# EAGLE design MD_plate (EAGLE 7.2.0)
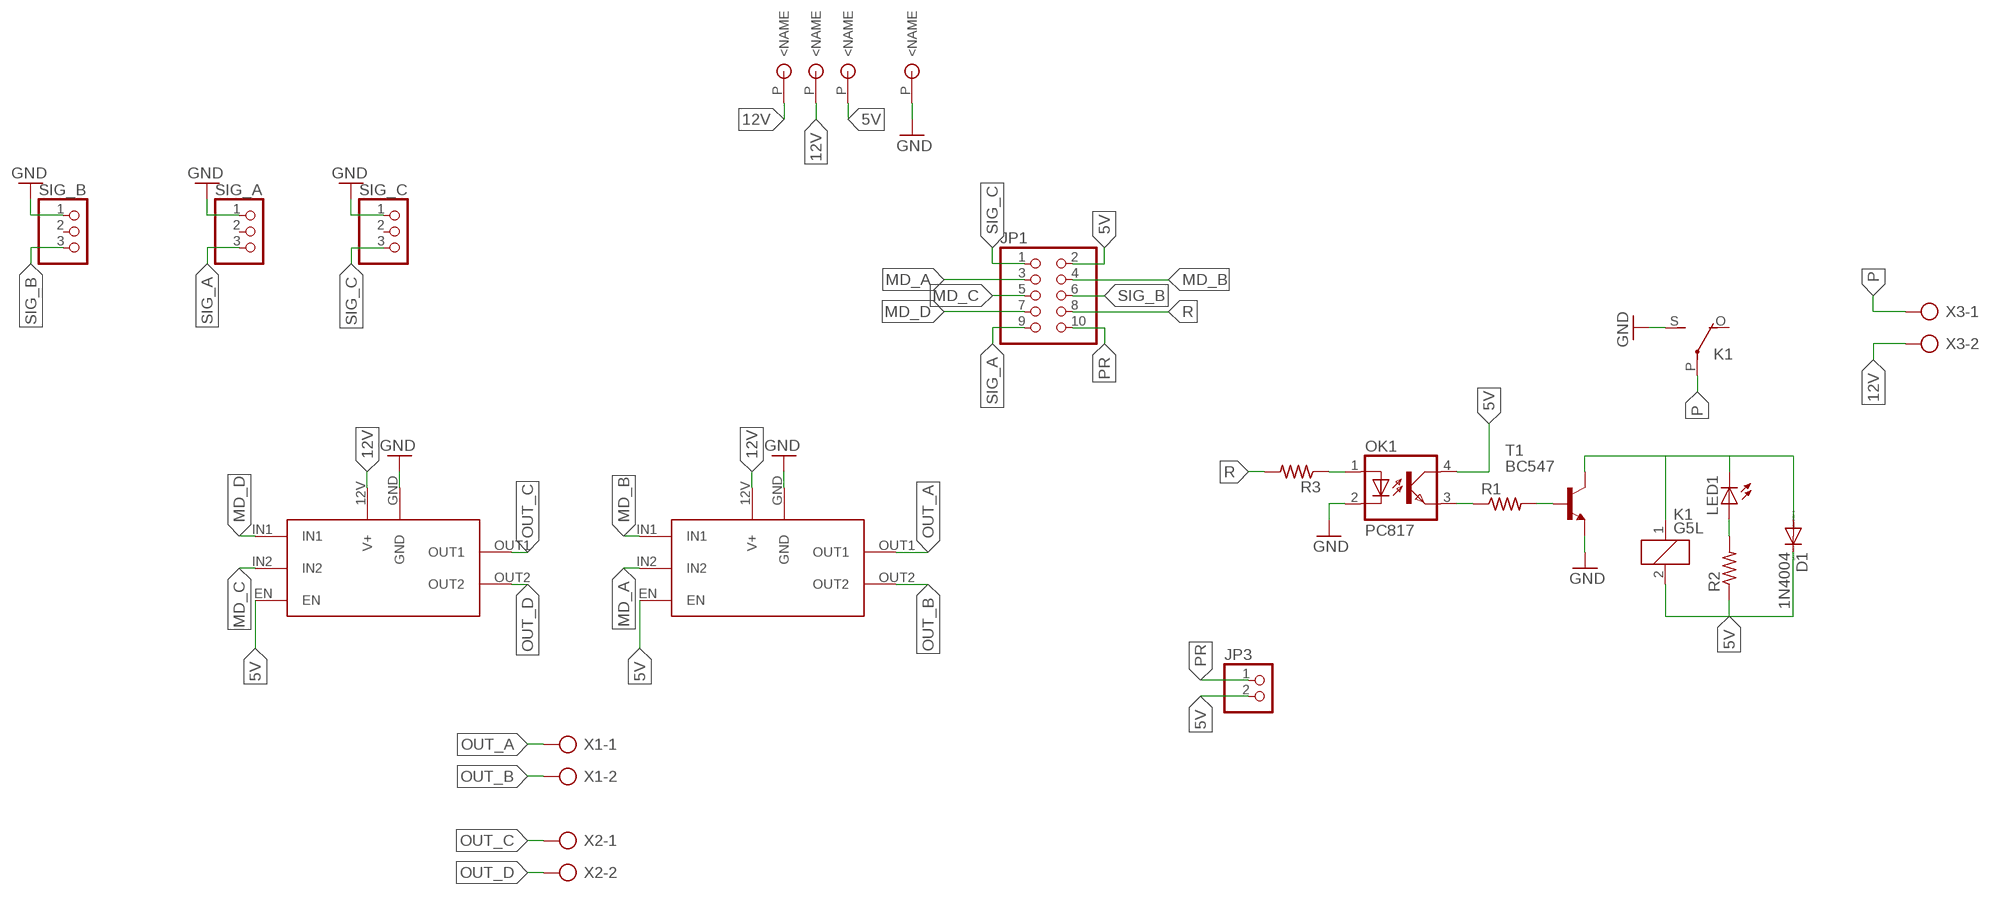
[diagram p0: schematic, sheet 1]

## Parts
6  CU-SPACER  [CU-SPACER]
12_A  CU-SPACER  [CU-SPACER]
12_B  CU-SPACER  [CU-SPACER]
D1  1N4004  [DO41-10]
JP1  PINHD-2X5  [2X05]
JP3  PINHD-1X2  [1X02]
K1  G5L  [G5LE]
LED1  LED3MM  [LED3MM]
OK1  PC817  [DIL04]
R1  R-US_0204/7  [0204/7]
R2  R-US_0204/7  [0204/7]
R3  R-US_0204/7  [0204/7]
SIG_A  PINHD-1X3/90  [1X03/90]
SIG_B  PINHD-1X3/90  [1X03/90]
SIG_C  PINHD-1X3/90  [1X03/90]
T1  BC547  [TO92]
U$1  L6203-MODULE  [L6203-MODULE]
U$2  L6203-MODULE  [L6203-MODULE]
U$6  CU-SPACER  [CU-SPACER]
X1  AK500/2  [AK500/2]
X2  AK500/2  [AK500/2]
X3  AK500/2  [AK500/2]

## Nets
5V: 6.P(<NAME) D1.C JP1.2 JP3.2 K1.2 OK1.4(COL) R2.1 U$1.EN U$2.EN
12V: 12_A.P(<NAME) 12_B.P(<NAME) U$1.12V(V+) U$2.12V(V+) X3.2
GND: K1.S(2:S) OK1.2(C) SIG_A.1 SIG_B.1 SIG_C.1 T1.1(E) U$1.GND U$2.GND U$6.P(<NAME)
MD_A: JP1.3 U$2.IN2
MD_B: JP1.4 U$2.IN1
MD_C: JP1.5 U$1.IN2
MD_D: JP1.7 U$1.IN1
N$2: OK1.3(EMIT) R1.1
N$3: R1.2 T1.2(B)
N$4: LED1.A R2.2
N$5: OK1.1(A) R3.1
N$6: D1.A K1.1 LED1.K(C) T1.3(C)
OUT_A: U$2.OUT1 X1.1
OUT_B: U$2.OUT2 X1.2
OUT_C: U$1.OUT1 X2.1
OUT_D: U$1.OUT2 X2.2
P: K1.P(2:P) X3.1
PR: JP1.10 JP3.1
R: JP1.8 R3.2
SIG_A: JP1.9 SIG_A.3
SIG_B: JP1.6 SIG_B.3
SIG_C: JP1.1 SIG_C.3
Unconnected: K1.O(2:O) SIG_A.2 SIG_B.2 SIG_C.2

## Library data of the parts
6 12_A 12_B U$6 = Aquaphoton:CU-SPACER
D1 = diode:1N4004: DIODE general purpose rectifier, 1 A
JP1 = pinhead:PINHD-2X5: PIN HEADER
JP3 = pinhead:PINHD-1X2: PIN HEADER
K1 = relay:G5L: RELAY 1 x switch, 10 A/120 V AC, 8 A/30 V ADC, Omron; OC_FARNELL: unknown; OC_NEWARK: unknown
LED1 = led:LED: LED OSRAM: - CHIPLED LG R971, LG N971, LY N971, LG Q971, LY Q971, LO R971, LY R971 LH N974, LH R974 LS Q976, LO Q976, LY Q976 LO Q996 - Hyper CHIPLED LW Q18S LB Q993, LB Q99A, LB R99A - SideLED LS A670, LO A670, LY A670, LG A670, LP A670 LB A673, LV A673, LT A673, LW A673 LH A674 LY A675 LS A676, LA A676, LO A676, LY A676, LW A676 LS A679, LY A679, LG A679 - Hyper Micro SIDELED® LS Y876, LA Y876, LO Y876, LY Y876 LT Y87S - SmartLED LW L88C, LW L88S LB L89C, LB L89S, LG L890 LS L89K, LO L89K, LY L89K LS L896, LA L896, LO L896, LY L896 - TOPLED LS T670, LO T670, LY T670, LG T670, LP T670 LSG T670, LSP T670, LSY T670, LOP T670, LYG T670 LG T671, LOG T671, LSG T671 LB T673, LV T673, LT T673, LW T673 LH T674 LS T676, LA T676, LO T676, LY T676, LB T676, LH T676, LSB T676, LW T676 LB T67C, LV T67C, LT T67C, LS T67K, LO T67K, LY T67K, LW E67C LS E67B, LA E67B, LO E67B, LY E67B, LB E67C, LV E67C, LT E67C LW T67C LS T679, LY T679, LG T679 LS T770, LO T770, LY T770, LG T770, LP T770 LB T773, LV T773, LT T773, LW T773 LH T774 LS E675, LA E675, LY E675, LS T675 LS T776, LA T776, LO T776, LY T776, LB T776 LHGB T686 LT T68C, LB T68C - Hyper Mini TOPLED® LB M676 - Mini TOPLED Santana® LG M470 LS M47K, LO M47K, LY M47K Source: http://www.osram.convergy.de LUXEON: - LUMILED® LXK2-PW12-R00, LXK2-PW12-S00, LXK2-PW14-U00, LXK2-PW14-V00 LXK2-PM12-R00, LXK2-PM12-S00, LXK2-PM14-U00 LXK2-PE12-Q00, LXK2-PE12-R00, LXK2-PE12-S00, LXK2-PE14-T00, LXK2-PE14-U00 LXK2-PB12-K00, LXK2-PB12-L00, LXK2-PB12-M00, LXK2-PB14-N00, LXK2-PB14-P00, LXK2-PB14-Q00 LXK2-PR12-L00, LXK2-PR12-M00, LXK2-PR14-Q00, LXK2-PR14-R00 LXK2-PD12-Q00, LXK2-PD12-R00, LXK2-PD12-S00 LXK2-PH12-R00, LXK2-PH12-S00 LXK2-PL12-P00, LXK2-PL12-Q00, LXK2-PL12-R00 Source: www.luxeon.com KINGBRIGHT: KA-3528ASYC Source: www.kingbright.com
OK1 = optocoupler:PC817: SHARP OPTO COUPLER; MPN: PC817X4J000F; OC_FARNELL: 9707727; OC_NEWARK: 97K7059
R1-R3 = rcl:R-US_: RESISTOR, American symbol
SIG_A SIG_B SIG_C = pinhead:PINHD-1X3: PIN HEADER
T1 = transistor:BC547: NPN TRANSISTOR
U$1 U$2 = Aquaphoton:L6203-MODULE
X1-X3 = con-ptr500:AK500/2: CONNECTOR; OC_FARNELL: unknown; OC_NEWARK: unknown

## Board
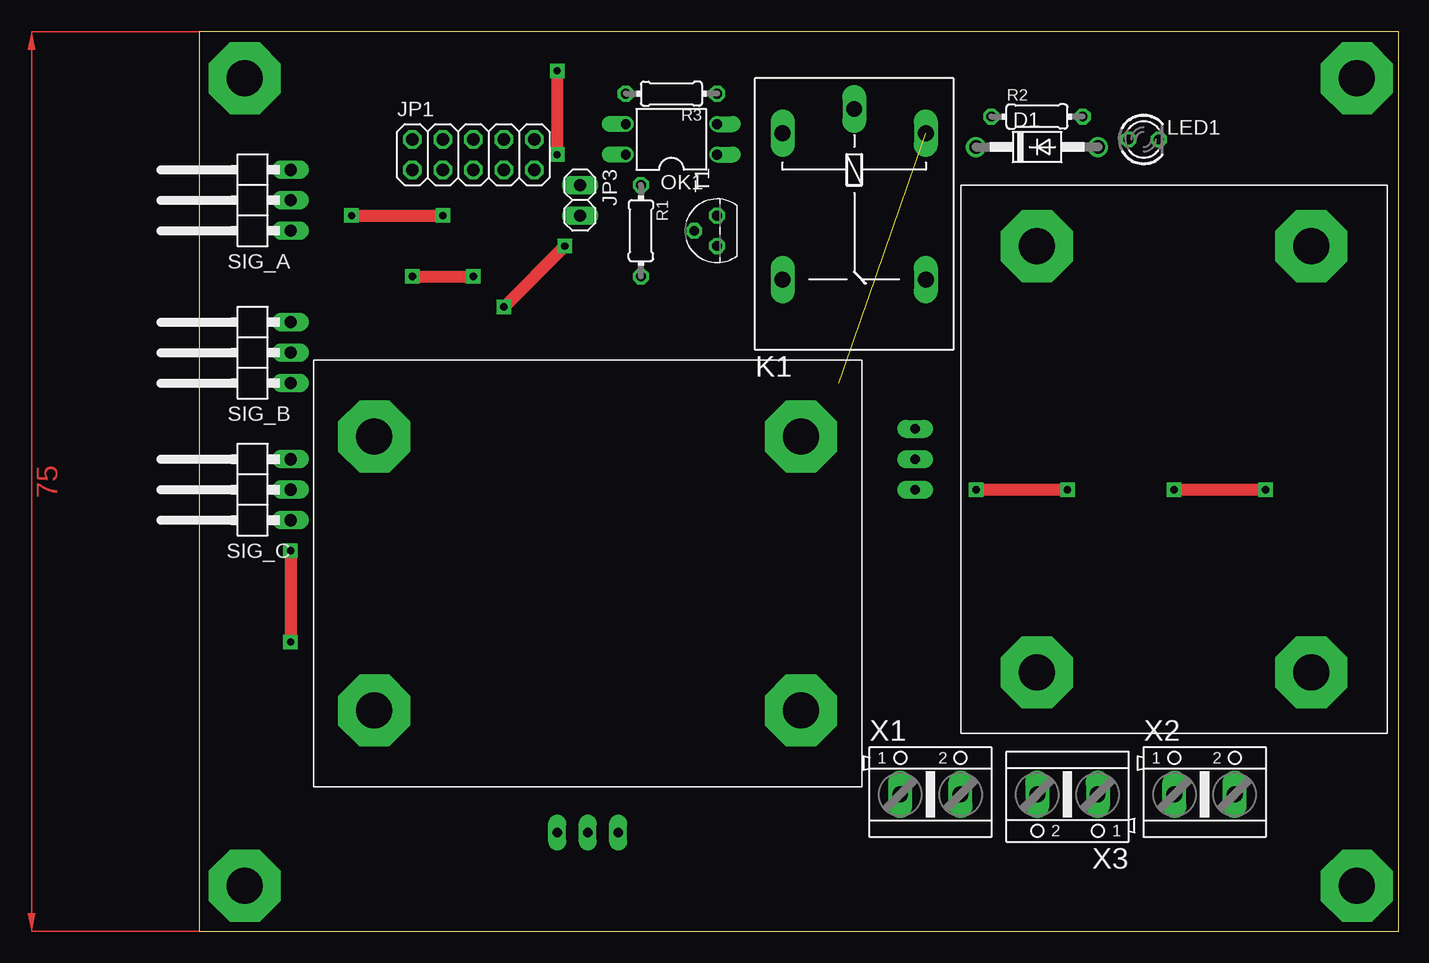
[diagram p1: board, top side]
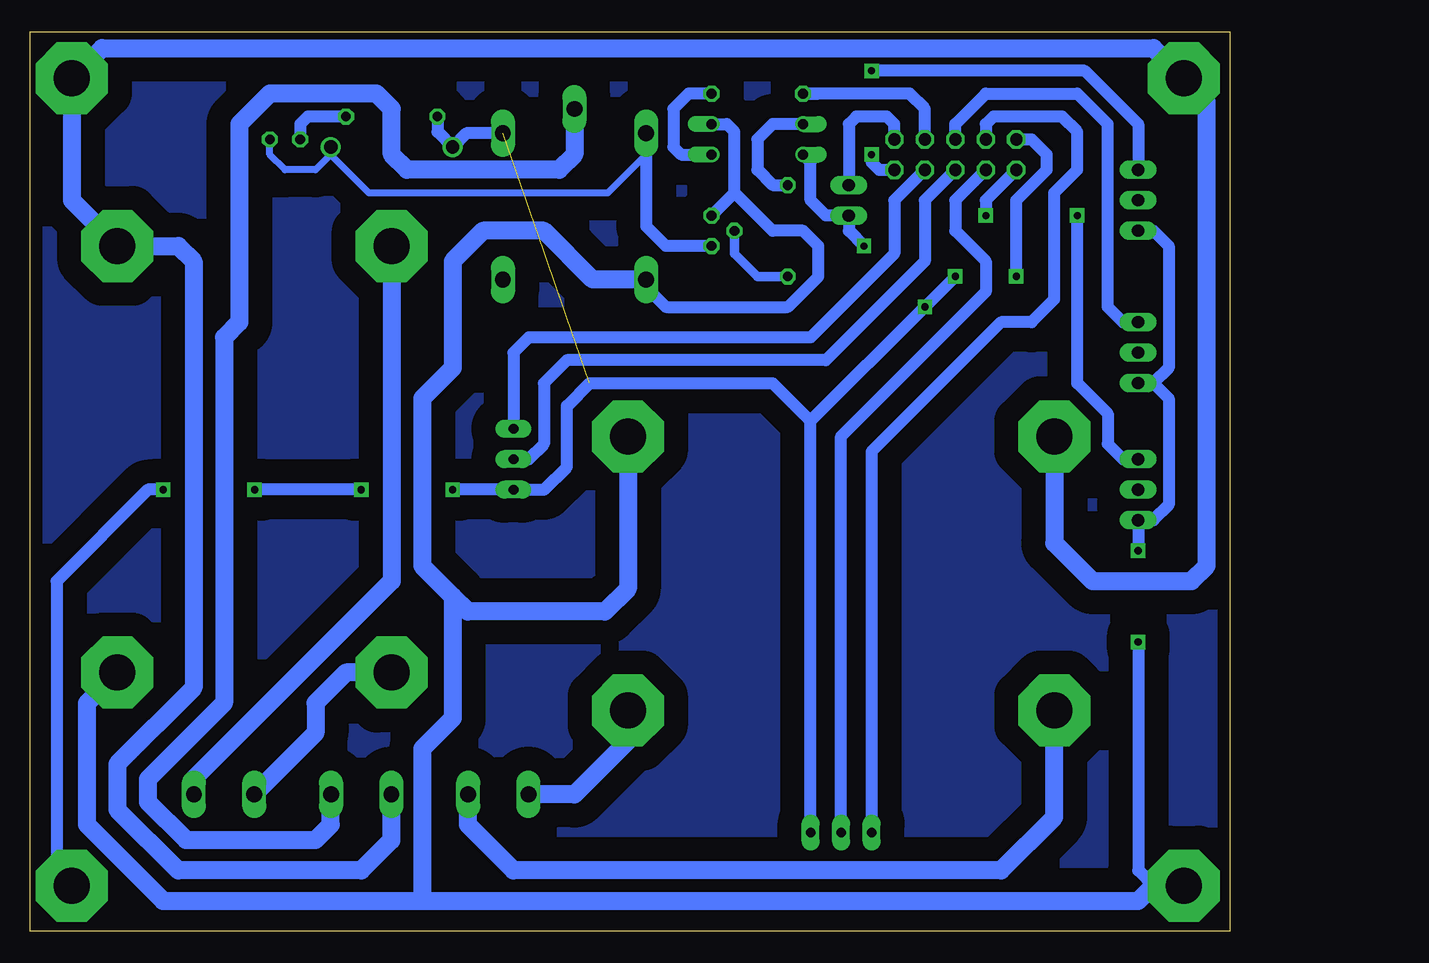
[diagram p2: board, bottom side, seen from below]

Size 100 x 75 mm. Coordinates in mm from the lower left corner, seen from the top.
Outline: 0,0 100,0 100,75 0,75 0,0
Copper layers (1*16): Top 0.035mm / dielectric 1.5mm / Bottom 0.035mm
Design rules "default *": minimum track width 10mil, minimum drill 24mil, track to track 2mm, track to pad 2mm, pad to pad 8mil, via to via 8mil, smd to smd 8mil, copper to edge 40mil, drill to drill 8mil, minimum pad ring 10mil, minimum via ring 8mil, stop-mask expansion 4mil, vias tented up to drill 0mil, thermal gap 10mil

### Footprints (pad centres in the part's own frame; a part is rotated, then mirrored left to right if it is on the bottom)
CU-SPACER = drill 3 pad 6 octagon: P 0,0
DO41-10 = drill 1.118: A 5.08,0; C -5.08,0
2X05 = drill 1.016 octagon: 1 -5.08,-1.27; 2 -5.08,1.27; 3 -2.54,-1.27; 4 -2.54,1.27; 5 0,-1.27; 6 0,1.27; 7 2.54,-1.27; 8 2.54,1.27; 9 5.08,-1.27; 10 5.08,1.27
1X02 = drill 1.016 long: 1 -1.27,0; 2 1.27,0
G5LE = drill 1.321 long: 1 -7.493,-5.969; 2 -7.493,5.969; O 4.699,5.969; P -9.525,0; S 4.699,-5.969
LED3MM = drill 0.813 octagon: A -1.27,0; K 1.27,0
DIL04 = drill 0.813 offset: 1 -1.27,-3.81; 2 1.27,-3.81; 3 1.27,3.81; 4 -1.27,3.81
0204/7 = drill 0.813 octagon: 1 -3.81,0; 2 3.81,0
1X03/90 = drill 1.016 long: 1 -2.54,-3.81; 2 0,-3.81; 3 2.54,-3.81
TO92 = drill 0.813 octagon: 1 1.27,0; 2 0,1.905; 3 -1.27,0
L6203-MODULE = drill 3 pad 6 octagon: 12V 5.08,29.21; GND 40.64,29.21; OUT1 40.64,6.35; OUT2 5.08,6.35 | drill 0.8 pad 1.5 long: EN 25.4,-3.81; IN1 20.32,-3.81; IN2 22.86,-3.81
AK500/2 = drill 1.321 long: 1 -2.515,0; 2 2.515,0

### Placement (x,y rotation side)
6  96.52,3.81 0 top
12_A  3.81,71.12 0 top
12_B  96.52,71.12 0 top
D1  69.85,65.41 0 top
JP1  22.86,64.77 0 top
JP3  31.75,60.96 270 top
K1  54.61,59.05 270 top
LED1  78.74,66.04 0 top
OK1  39.37,66.04 90 top
R1  36.83,58.42 270 top
R2  69.85,67.94 0 top
R3  39.37,69.85 180 top
SIG_A  3.81,60.96 90 top
SIG_B  3.81,48.26 90 top
SIG_C  3.81,36.83 90 top
T1  43.18,58.42 90 top
U$1  63.5,62.23 270 top
U$2  9.53,12.06 0 top
U$6  3.81,3.81 0 top
X1  60.96,11.43 0 top
X2  83.82,11.43 0 top
X3  72.39,11.43 180 top

### Tracks (layer width: path | path; a pad name or v marks a point on that pad's centre or on a via)
5V  (via drill 0.6 pad 1.2)  (1 unrouted)
  Top 1: v64.77,36.83 v72.39,36.83 | v17.78,54.61 v22.86,54.61 | v30.48,57.15 v25.4,52.07 | v81.28,36.83 v88.9,36.83
  Bottom 1: U$2.EN 34.92,42.55 | 34.92,42.55 38.1,45.72 53.34,45.72 55.24,43.81 55.24,38.73 57.15,36.83 U$1.EN v64.77,36.83 | 6.P 97.79,5.08 97.79,29.21 90.17,36.83 v88.9,36.83 | v22.86,54.61 v25.4,52.07 34.92,42.55 | v72.39,36.83 v81.28,36.83 | JP1.2 16.51,66.04 15.24,64.77 15.24,63.5 17.78,60.96 v17.78,54.61 | OK1.4 34.92,64.14 34.92,60.96 33.66,59.69 JP3.2 31.75,58.42 v30.48,57.15 | K1.2 63.63,66.55 D1.C 66.04,66.67 R2.1
12V
  Bottom 1.5: U$2.12V 14.61,32.38 11.43,29.21 3.17,29.21 1.91,30.48 1.91,69.22 12_A.P 6.35,73.66 93.98,73.66 12_B.P 96.52,60.96 U$1.12V 87.63,57.15 86.36,55.88 86.36,20.32 92.71,13.97 92.71,10.16 87.63,5.08 72.39,5.08 69.88,7.59 X3.2
GND  (via drill 0.6 pad 1.2)
  Top 1: v7.62,31.75 v7.62,24.13
  Bottom 1: OK1.2 41.91,67.31 41.27,66.67 41.27,61.59 | SIG_A.1 6.35,58.42 5.08,57.15 5.08,46.99 6.35,45.72 | SIG_B.1 6.35,45.72 | 6.35,45.72 5.08,44.45 5.08,35.56 6.35,34.29 SIG_C.1 v7.62,31.75 | T1.1 41.27,61.59 | K1.S 48.64,53.72 46.99,52.07 36.83,52.07 34.29,54.61 34.29,57.15 35.56,58.42 38.1,58.42 41.27,61.59 | v7.62,24.13 7.62,5.08 6.35,3.81
  Bottom 1.5: 67.31,2.54 88.9,2.54 95.25,8.89 95.25,19.05 U$1.GND | 67.31,2.54 7.62,2.54 6.35,3.81 U$6.P | U$2.GND 50.16,28.57 52.07,26.67 63.5,26.67 64.77,27.94 | K1.S 53.09,54.36 57.15,58.42 62.23,58.42 64.77,55.88 64.77,46.99 67.31,44.45 67.31,30.48 64.77,27.94 | 64.77,27.94 64.77,17.78 67.31,15.24 67.31,2.54
MD_A
  Bottom 1: U$2.IN2 32.38,41.27 20.32,53.34 20.32,55.88 22.86,58.42 22.86,60.96 JP1.3
MD_B
  Bottom 1: U$2.IN1 29.84,40.01 19.05,50.8 16.51,50.8 14.61,52.7 14.61,61.59 12.7,63.5 12.7,66.67 13.97,67.94 19.68,67.94 20.32,67.31 JP1.4
MD_C
  Bottom 1: U$1.IN2 58.42,39.37 57.15,40.64 57.15,45.72 55.24,47.62 33.66,47.62 25.4,55.88 25.4,60.96 JP1.5
MD_D
  Bottom 1: U$1.IN1 59.69,48.26 58.42,49.53 34.92,49.53 27.94,56.52 27.94,60.96 JP1.7
N$1
  pour Bottom: 0,74.93 100.33,74.93 100.33,0 0,0
N$2
  Bottom 1: OK1.3 38.1,67.31 39.37,66.04 39.37,63.5 38.1,62.23 R1.1
N$3
  Bottom 0.8: T1.2 41.27,56.52 39.37,54.61 R1.2
N$4
  Bottom 1: LED1.A 77.47,67.31 76.83,67.94 R2.2
N$5
  Bottom 1: R3.1 45.09,69.85 46.35,68.58 46.35,65.41 45.72,64.77 OK1.1
N$6
  Bottom 0.6: 74.93,64.77 76.2,63.5 78.74,63.5 80.01,64.77 LED1.K | D1.A 74.93,64.77 | 74.93,64.77 71.75,61.59 51.82,61.59 48.64,64.77
  Bottom 1: T1.3 46.99,57.15 48.64,58.8 48.64,64.77 K1.1
OUT_A
  Bottom 1.5: U$2.OUT1 50.16,15.88 54.61,11.43 X1.1
OUT_B
  Bottom 1.5: U$2.OUT2 14.61,9.53 19.05,5.08 59.69,5.08 63.5,8.89 63.5,11.4 X1.2
OUT_C
  Bottom 1.5: U$1.OUT1 73.66,21.59 76.2,19.05 76.2,16.54 X2.1
OUT_D
  Bottom 1.5: U$1.OUT2 69.85,29.21 86.33,12.72 X2.2
P
  Bottom 1.5: K1.P 54.61,64.77 55.88,63.5 68.58,63.5 69.85,64.77 69.85,68.58 71.12,69.85 80.01,69.85 82.55,67.31 82.55,50.8 83.82,49.53 83.82,19.05 90.17,12.7 90.17,10.79 87,7.62 76.2,7.62 74.93,8.89 74.93,11.4 X3.1
PR
  Bottom 1: JP1.10 27.94,67.31 28.57,67.94 31.11,67.94 31.75,67.31 JP3.1
R
  Bottom 1: 34.29,69.85 R3.2 26.67,69.85 25.4,68.58 JP1.8
SIG_A  (via drill 0.6 pad 1.2)
  Top 1: v29.84,71.75 v29.84,64.77
  Bottom 1: SIG_A.3 7.62,67.31 12.06,71.75 v29.84,71.75 | JP1.9 29.21,63.5 29.84,64.14 v29.84,64.77
SIG_B
  Bottom 1: SIG_B.3 8.89,50.8 10.16,52.07 10.16,67.31 12.7,69.85 20.32,69.85 22.86,67.31 JP1.6
SIG_C  (via drill 0.6 pad 1.2)
  Top 1: v12.7,59.69 v20.32,59.69
  Bottom 1: SIG_C.3 8.89,39.37 10.16,40.64 10.16,43.18 12.7,45.72 v12.7,59.69 | JP1.1 20.32,60.96 v20.32,59.69
(copper drawn outside any net)
  shapes: Top area x1

### Text on the board
Top_sticker: 12V | 12V | * | D12 | D3 | 5V | - | D7 | - | D8 | D11 | D10 | - | D3 | + | GND | 5V | D6 | D9